# Altium schematic sheet MCU_Core.SchDoc
size A; SheetNumber: 4; SheetTotal: 10
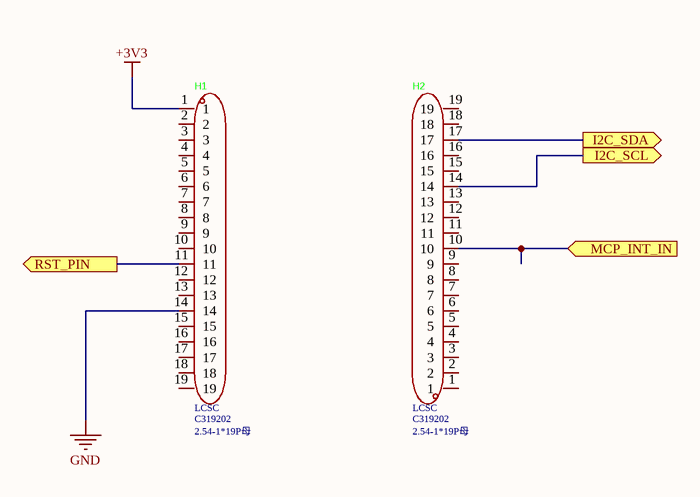
[diagram p0: MCU_Core.SchDoc]

## Parts
H1  Supplier: LCSC  Supplier Part: C319202  [HDR-TH_19P-P2.54-V-F]  (hidden comment: 2.54-1*19P母)
H2  Supplier: LCSC  Supplier Part: C319202  [HDR-TH_19P-P2.54-V-F]  (hidden comment: 2.54-1*19P母)

## Ports
I2C_SCL (out), I2C_SDA (out), MCP_INT_IN (in), RST_PIN (out)

## Nets
+3V3: H1.1
GND: H1.14
I2C_SCL: H2.14 ; port I2C_SCL
I2C_SDA: H2.17 ; port I2C_SDA
MCP_INT_IN: H2.10 ; port MCP_INT_IN
RST_PIN: H1.11 ; port RST_PIN

Not connected (* = marked no-connect by the designer): H1 2 3 4 5 6 7 8 9 10 12 13 15 16 17 18 19; H2 1 2 3 4 5 6 7 8 9 11 12 13 15 16 18 19

## Library data of the parts
H1 H2 = 2.54-1*19P母: Manufacturer: BOOMELE(博穆精密); Add into BOM: yes; Pitch: 2.54mm; Circular Hole / Square Hole: Square Hole; Number of Positions: 19P; Holes Direction: Top; Symbol: 2.54-1*19P母; Device: 2.54-1*19P母; LCSC Part Name: 间距:2.54mm 直插; Supplier Footprint: 插件,P=2.54mm; JLCPCB Part Class: Extended Part; Convert to PCB: yes; Row Spacing: -; Mounting Type: Through Hole; Number of Rows: 1; Insulation Height: -; Contact Material: -; Contact Plating: -; Manufacturer Part: 2.54-1*19P母